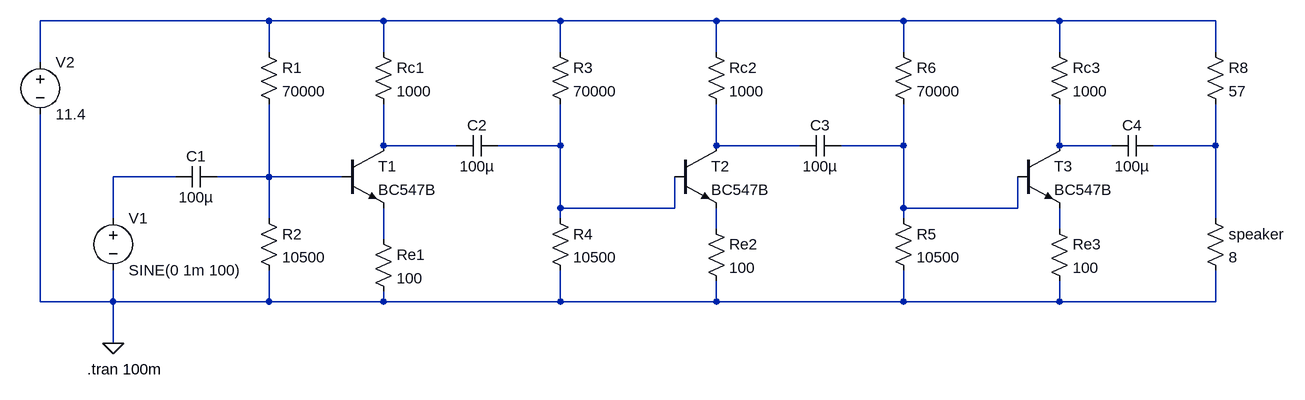
[diagram p0: schematic working-amplifier.asc]
working-amplifier.asc, the LTspice schematic file:
Version 4
SHEET 1 1800 680
WIRE 16 16 -336 16
WIRE 192 16 16 16
WIRE 464 16 192 16
WIRE 704 16 464 16
WIRE 992 16 704 16
WIRE 1232 16 992 16
WIRE 1472 16 1232 16
WIRE 16 64 16 16
WIRE 192 64 192 16
WIRE 464 64 464 16
WIRE 704 64 704 16
WIRE 992 64 992 16
WIRE 1232 64 1232 16
WIRE 1472 64 1472 16
WIRE -336 80 -336 16
WIRE 192 208 192 144
WIRE 304 208 192 208
WIRE 464 208 464 144
WIRE 464 208 368 208
WIRE 704 208 704 144
WIRE 832 208 704 208
WIRE 992 208 992 144
WIRE 992 208 896 208
WIRE 1232 208 1232 144
WIRE 1312 208 1232 208
WIRE 1472 208 1472 144
WIRE 1472 208 1376 208
WIRE -128 256 -224 256
WIRE 16 256 16 144
WIRE 16 256 -64 256
WIRE 128 256 16 256
WIRE 464 304 464 208
WIRE 640 304 640 256
WIRE 640 304 464 304
WIRE 992 304 992 208
WIRE 1168 304 1168 256
WIRE 1168 304 992 304
WIRE -224 320 -224 256
WIRE 16 320 16 256
WIRE 464 320 464 304
WIRE 992 320 992 304
WIRE 1472 320 1472 208
WIRE 704 336 704 304
WIRE 1232 336 1232 304
WIRE 192 352 192 304
WIRE -336 448 -336 160
WIRE -224 448 -224 400
WIRE -224 448 -336 448
WIRE 16 448 16 400
WIRE 16 448 -224 448
WIRE 192 448 192 432
WIRE 192 448 16 448
WIRE 464 448 464 400
WIRE 464 448 192 448
WIRE 704 448 704 416
WIRE 704 448 464 448
WIRE 992 448 992 400
WIRE 992 448 704 448
WIRE 1232 448 1232 416
WIRE 1232 448 992 448
WIRE 1472 448 1472 400
WIRE 1472 448 1232 448
WIRE -224 512 -224 448
FLAG -224 512 0
SYMBOL npn 128 208 R0
SYMATTR InstName T1
SYMATTR Value BC547B
SYMBOL voltage -336 64 R0
WINDOW 123 0 0 Left 0
WINDOW 39 0 0 Left 0
SYMATTR InstName V2
SYMATTR Value 11.4
SYMBOL res 0 48 R0
SYMATTR InstName R1
SYMATTR Value 70000
SYMBOL res 0 304 R0
SYMATTR InstName R2
SYMATTR Value 10500
SYMBOL res 176 48 R0
SYMATTR InstName Rc1
SYMATTR Value 1000
SYMBOL cap -128 272 R270
WINDOW 0 32 32 VTop 2
WINDOW 3 0 32 VBottom 2
SYMATTR InstName C1
SYMATTR Value 100µ
SYMBOL voltage -224 304 R0
WINDOW 123 0 0 Left 0
WINDOW 39 0 0 Left 0
SYMATTR InstName V1
SYMATTR Value SINE(0 1m 100)
SYMBOL res 448 304 R0
SYMATTR InstName R4
SYMATTR Value 10500
SYMBOL npn 640 208 R0
SYMATTR InstName T2
SYMATTR Value BC547B
SYMBOL res 688 48 R0
SYMATTR InstName Rc2
SYMATTR Value 1000
SYMBOL res 688 320 R0
SYMATTR InstName Re2
SYMATTR Value 100
SYMATTR SpiceLine pwr=1
SYMBOL res 176 336 R0
SYMATTR InstName Re1
SYMATTR Value 100
SYMBOL cap 304 224 R270
WINDOW 0 32 32 VTop 2
WINDOW 3 0 32 VBottom 2
SYMATTR InstName C2
SYMATTR Value 100µ
SYMBOL res 448 48 R0
SYMATTR InstName R3
SYMATTR Value 70000
SYMBOL res 976 304 R0
SYMATTR InstName R5
SYMATTR Value 10500
SYMBOL npn 1168 208 R0
SYMATTR InstName T3
SYMATTR Value BC547B
SYMBOL res 1216 48 R0
SYMATTR InstName Rc3
SYMATTR Value 1000
SYMBOL res 1216 320 R0
SYMATTR InstName Re3
SYMATTR Value 100
SYMATTR SpiceLine pwr=1
SYMBOL cap 832 224 R270
WINDOW 0 32 32 VTop 2
WINDOW 3 0 32 VBottom 2
SYMATTR InstName C3
SYMATTR Value 100µ
SYMBOL res 976 48 R0
SYMATTR InstName R6
SYMATTR Value 70000
SYMBOL res 1456 304 R0
SYMATTR InstName speaker
SYMATTR Value 8
SYMBOL cap 1312 224 R270
WINDOW 0 32 32 VTop 2
WINDOW 3 0 32 VBottom 2
SYMATTR InstName C4
SYMATTR Value 100µ
SYMBOL res 1456 48 R0
SYMATTR InstName R8
SYMATTR Value 57
TEXT -264 552 Left 2 !.tran 100m

The netlist it stands for:
* working-amplifier.asc
Q§T1 N002 N009 N012 0 BC547B
V2 N001 0 11.4
R1 N001 N009 70000
R2 N009 0 10500
Rc1 N001 N002 1000
C1 N008 N009 100µ
V1 N008 0 SINE(0 1m 100)
R4 N003 0 10500
Q§T2 N004 N003 N010 0 BC547B
Rc2 N001 N004 1000
Re2 N010 0 100 pwr=1
Re1 N012 0 100
C2 N002 N003 100µ
R3 N001 N003 70000
R5 N005 0 10500
Q§T3 N006 N005 N011 0 BC547B
Rc3 N001 N006 1000
Re3 N011 0 100 pwr=1
C3 N004 N005 100µ
R6 N001 N005 70000
R§speaker N007 0 8
C4 N006 N007 100µ
R8 N001 N007 57
.model NPN NPN
.model PNP PNP
.lib standard.bjt
.tran 100m
.backanno
.end